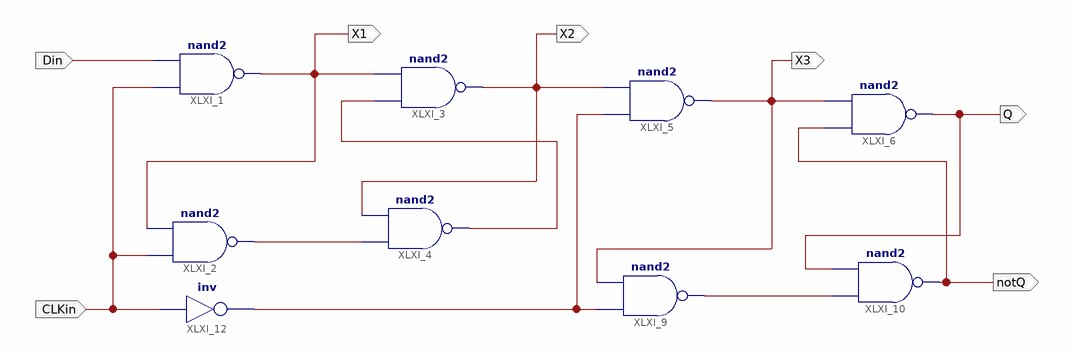
[diagram p0: schematic sheet 1]
// Xilinx ISE schematic dff02e.sch (spartan3e) as structural Verilog: 9 symbols, 7 ports
module dff02e (
  input  Din,
  input  CLKin,
  output X2,
  output Q,
  output notQ,
  output X3,
  output X1
);

  wire XLXN_6, XLXN_19, XLXN_23, XLXN_25;

  nand XLXI_1 (X1, CLKin, Din);
  nand XLXI_2 (XLXN_25, CLKin, X1);
  nand XLXI_3 (X2, XLXN_6, X1);
  nand XLXI_4 (XLXN_6, XLXN_25, X2);
  nand XLXI_5 (X3, XLXN_23, X2);
  not XLXI_12 (XLXN_23, CLKin);
  nand XLXI_6 (Q, notQ, X3);
  nand XLXI_10 (notQ, XLXN_19, Q);
  nand XLXI_9 (XLXN_19, XLXN_23, X3);
endmodule
